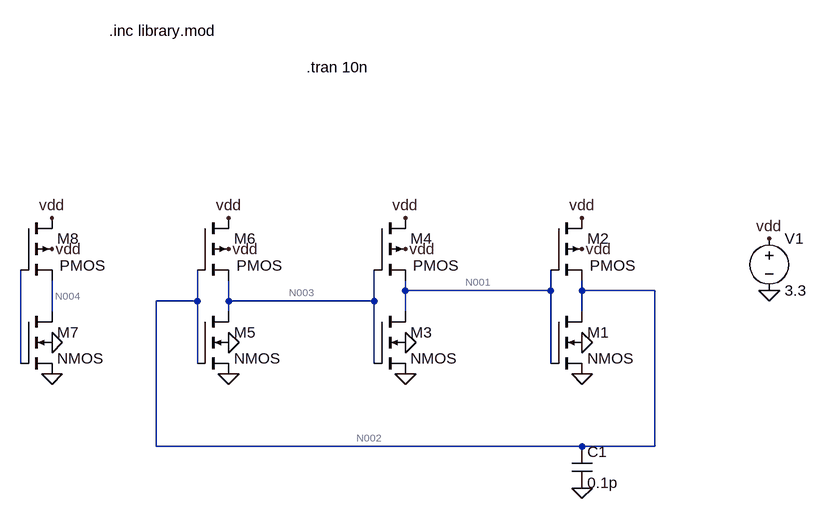
[diagram p0: schematic Draft7.asc]
Draft7.asc, the LTspice schematic file:
Version 4
SHEET 1 944 680
WIRE 320 272 320 256
WIRE 544 272 544 240
WIRE 544 272 320 272
WIRE 592 272 592 256
WIRE 704 272 592 272
WIRE 0 288 0 240
WIRE 0 288 -64 288
WIRE 48 288 48 256
WIRE 272 288 272 240
WIRE 272 288 48 288
WIRE -224 304 -224 256
WIRE 48 304 48 288
WIRE 320 304 320 272
WIRE 592 304 592 272
WIRE -272 384 -272 240
WIRE 0 384 0 288
WIRE 272 384 272 288
WIRE 544 384 544 272
WIRE -64 512 -64 288
WIRE 592 512 -64 512
WIRE 704 512 704 272
WIRE 704 512 592 512
FLAG 592 352 0
FLAG 592 400 0
FLAG 880 272 0
FLAG 880 192 vdd
FLAG 592 160 vdd
FLAG 592 208 vdd
FLAG 320 352 0
FLAG 320 400 0
FLAG 320 160 vdd
FLAG 320 208 vdd
FLAG 48 352 0
FLAG 48 400 0
FLAG 48 160 vdd
FLAG 48 208 vdd
FLAG -224 352 0
FLAG -224 400 0
FLAG -224 160 vdd
FLAG -224 208 vdd
FLAG 592 576 0
SYMBOL voltage 880 176 R0
WINDOW 123 0 0 Left 0
WINDOW 39 0 0 Left 0
SYMATTR InstName V1
SYMATTR Value 3.3
SYMBOL nmos4 544 304 R0
SYMATTR InstName M1
SYMATTR Value2 l=0.35u w=1u
SYMBOL pmos4 544 160 R0
WINDOW 3 60 73 Left 2
SYMATTR InstName M2
SYMATTR Value2 l=0.35u w=1u
SYMBOL nmos4 272 304 R0
SYMATTR InstName M3
SYMATTR Value2 l=0.35u w=1u
SYMBOL pmos4 272 160 R0
WINDOW 3 60 73 Left 2
SYMATTR InstName M4
SYMATTR Value2 l=0.35u w=1u
SYMBOL nmos4 0 304 R0
SYMATTR InstName M5
SYMATTR Value2 l=0.35u w=1u
SYMBOL pmos4 0 160 R0
WINDOW 3 60 73 Left 2
SYMATTR InstName M6
SYMATTR Value2 l=0.35u w=1u
SYMBOL nmos4 -272 304 R0
SYMATTR InstName M7
SYMATTR Value2 l=0.35u w=1u
SYMBOL pmos4 -272 160 R0
WINDOW 3 60 73 Left 2
SYMATTR InstName M8
SYMATTR Value2 l=0.35u w=1u
SYMBOL cap 576 512 R0
SYMATTR InstName C1
SYMATTR Value 0.1p
TEXT -136 -128 Left 2 !.inc library.mod
TEXT 168 -72 Left 2 !.tran 10n

The netlist it stands for:
* Draft7.asc
V1 vdd 0 3.3
M1 N002 N001 0 0 NMOS l=0.35u w=1u
M2 vdd N001 N002 vdd PMOS l=0.35u w=1u
M3 N001 N003 0 0 NMOS l=0.35u w=1u
M4 vdd N003 N001 vdd PMOS l=0.35u w=1u
M5 N003 N002 0 0 NMOS l=0.35u w=1u
M6 vdd N002 N003 vdd PMOS l=0.35u w=1u
M7 N004 N005 0 0 NMOS l=0.35u w=1u
M8 vdd N005 N004 vdd PMOS l=0.35u w=1u
C1 N002 0 0.1p
.model NMOS NMOS
.model PMOS PMOS
.lib standard.mos
.inc library.mod
.tran 10n
.backanno
.end

* Results of the author's LTspice run, read from the files saved beside the schematic
* Operating Point, zero values left out:
*   V(vdd) = 3.3 V
*   V(n002) = 1.282 V
*   V(n001) = 1.282 V
*   V(n003) = 1.282 V
*   V(n004) = 3.3 V
*   Id(M8) = 3.463 pA
*   Is(M8) = -3.463 pA
*   Id(M6) = 71.14 µA
*   Ib(M6) = 2.028 pA
*   Is(M6) = -71.14 µA
*   Id(M4) = 71.14 µA
*   Ib(M4) = 2.028 pA
*   Is(M4) = -71.14 µA
*   Id(M2) = 71.14 µA
*   Ib(M2) = 2.028 pA
*   Is(M2) = -71.14 µA
*   Id(M7) = 3.463 pA
*   Ib(M7) = -3.31 pA
*   Id(M5) = 71.14 µA
*   Ib(M5) = -1.292 pA
*   Is(M5) = -71.14 µA
*   Id(M3) = 71.14 µA
*   Ib(M3) = -1.292 pA
*   Is(M3) = -71.14 µA
*   Id(M1) = 71.14 µA
*   Ib(M1) = -1.292 pA
*   Is(M1) = -71.14 µA
*   I(V1) = -213.4 µA